# Altium project LightController_SimpleCombo.PrjPCB
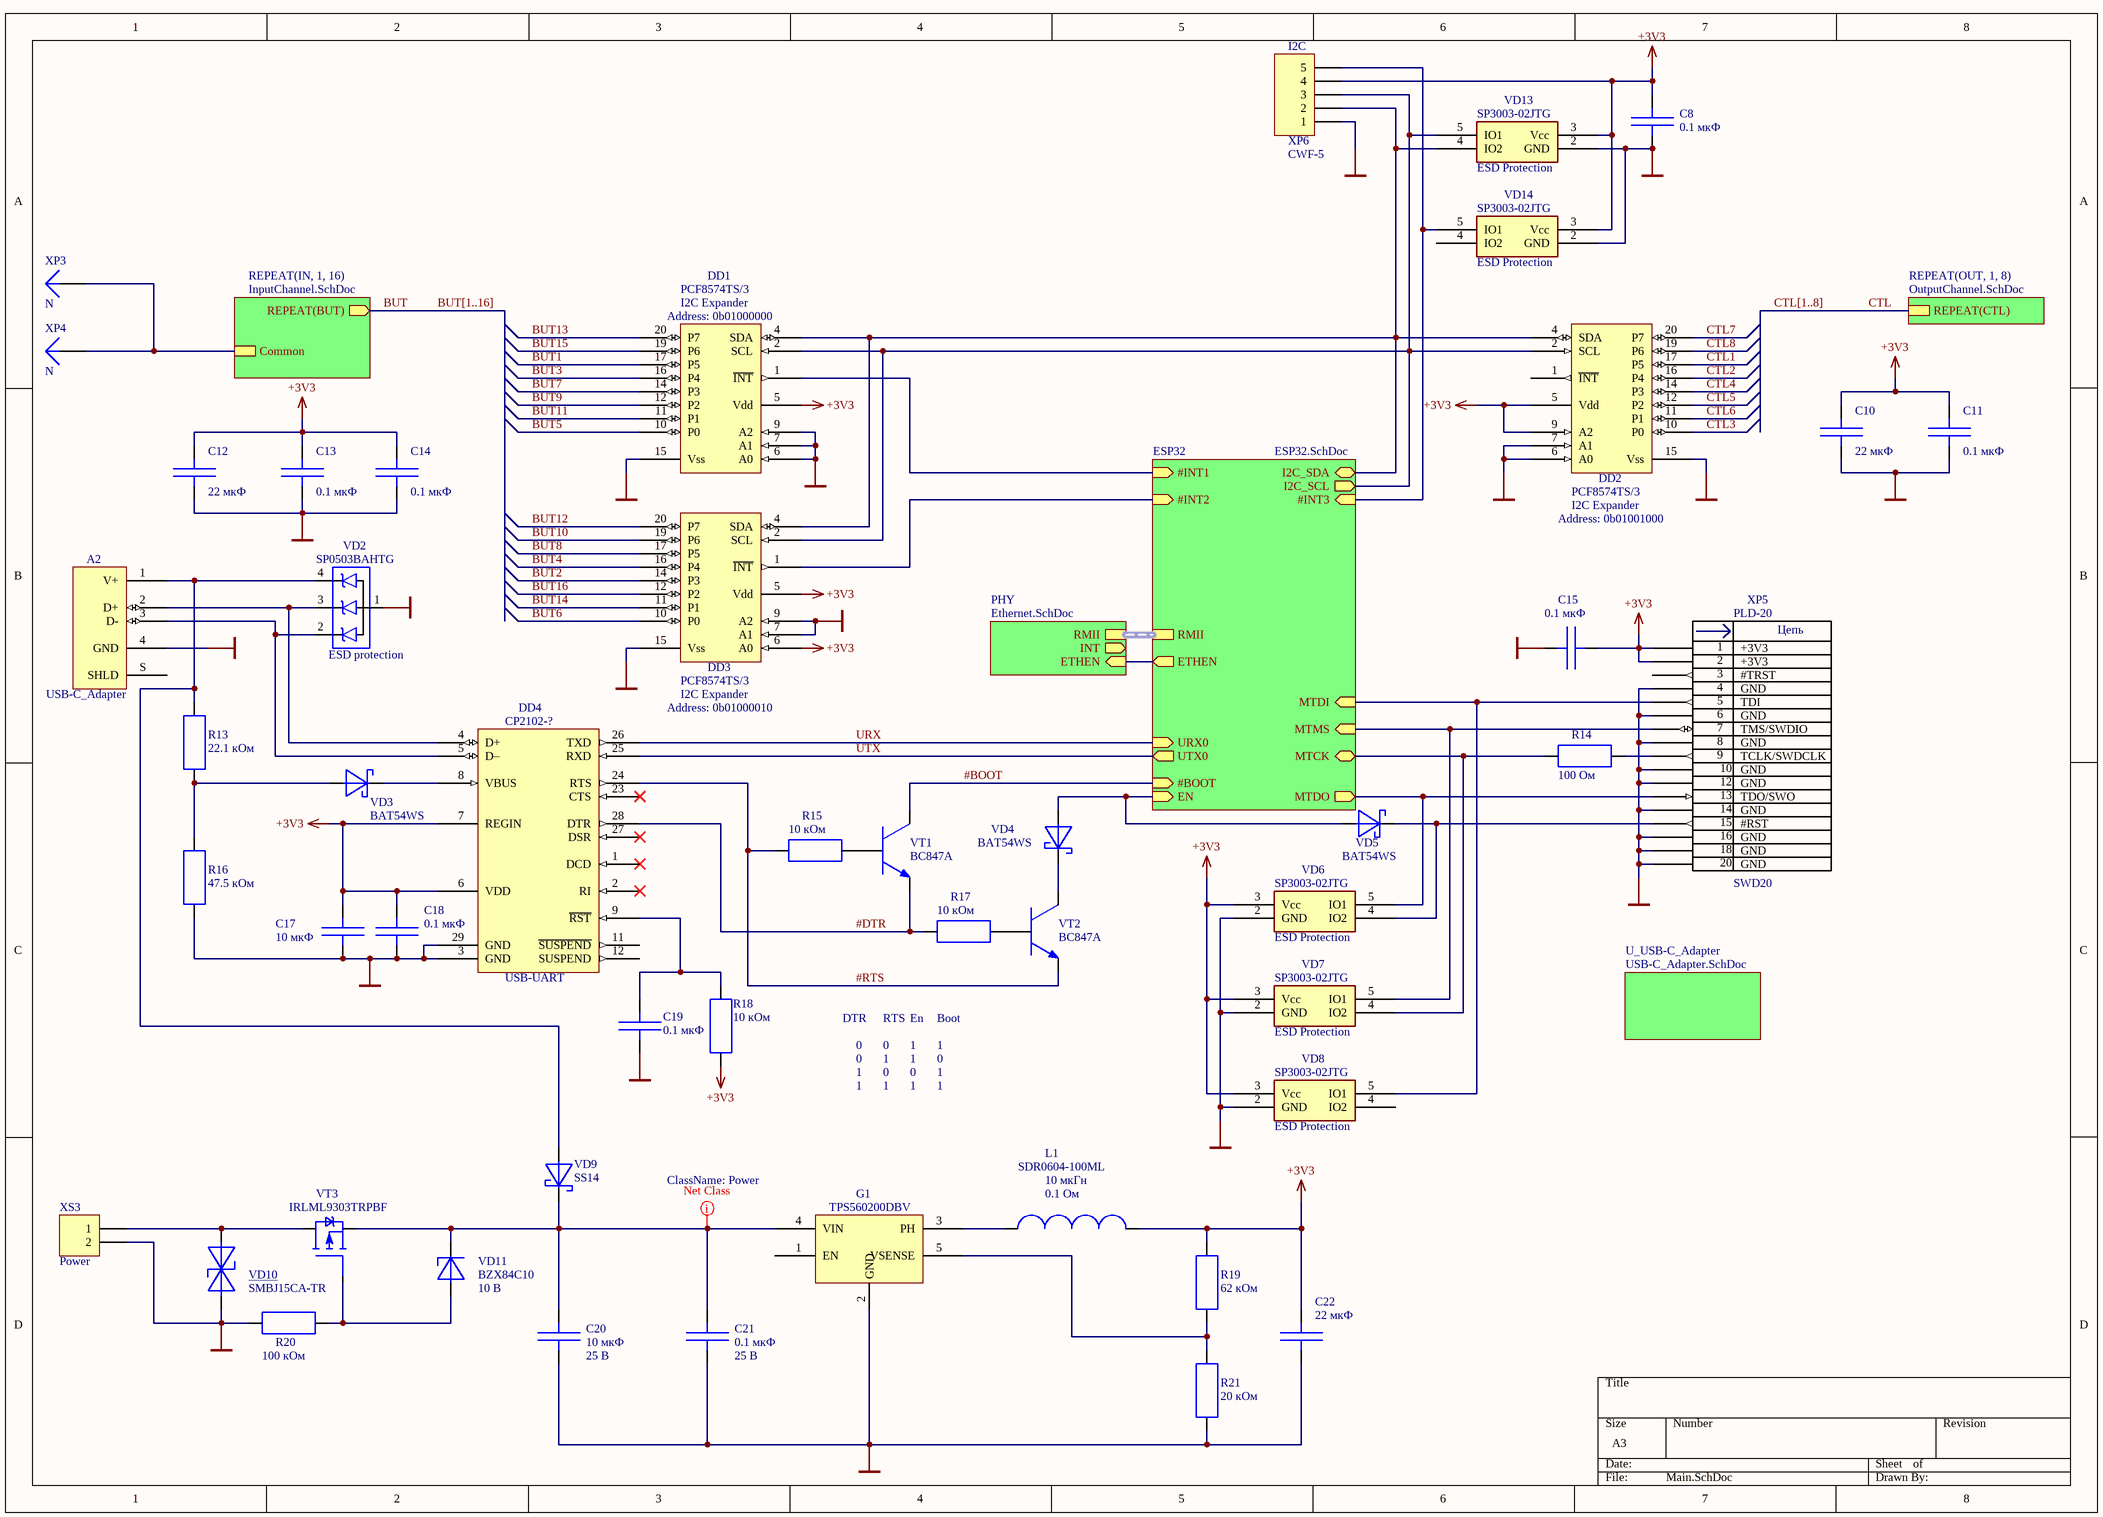
[diagram p0: Main.SchDoc]
6 sheets, 337 parts. Net scope: hierarchical (ports join the sheet entries above them; power ports are global).
Board files: LightController_SimpleCombo.PcbDoc, Usb_Adapter.PcbDoc
Sheets:
  Main.SchDoc
    ESP32 = ESP32.SchDoc
    OUT1 = OutputChannel.SchDoc
    OUT2 = OutputChannel.SchDoc
    OUT3 = OutputChannel.SchDoc
    OUT4 = OutputChannel.SchDoc
    OUT5 = OutputChannel.SchDoc
    OUT6 = OutputChannel.SchDoc
    OUT7 = OutputChannel.SchDoc
    OUT8 = OutputChannel.SchDoc
    IN1 = InputChannel.SchDoc
    IN2 = InputChannel.SchDoc
    IN3 = InputChannel.SchDoc
    IN4 = InputChannel.SchDoc
    IN5 = InputChannel.SchDoc
    IN6 = InputChannel.SchDoc
    IN7 = InputChannel.SchDoc
    IN8 = InputChannel.SchDoc
    IN9 = InputChannel.SchDoc
    IN10 = InputChannel.SchDoc
    IN11 = InputChannel.SchDoc
    IN12 = InputChannel.SchDoc
    IN13 = InputChannel.SchDoc
    IN14 = InputChannel.SchDoc
    IN15 = InputChannel.SchDoc
    IN16 = InputChannel.SchDoc
    PHY = Ethernet.SchDoc
    U_USB-C_Adapter = USB-C_Adapter.SchDoc

## Sheet Main.SchDoc
size A3

### Parts
A2  USB-C_Adapter  [Usb-C_Adapter]  (no BOM)
C8  value 0.1 мкФ  [CAP_0603-1608]  (hidden comment: Cap)
C10  value 22 мкФ  [CAP_0805-2012]  (hidden comment: Cap)
C11  value 0.1 мкФ  [CAP_0603-1608]  (hidden comment: Cap)
C12  value 22 мкФ  [CAP_0805-2012]  (hidden comment: Cap)
C13  value 0.1 мкФ  [CAP_0603-1608]  (hidden comment: Cap)
C14  value 0.1 мкФ  [CAP_0603-1608]  (hidden comment: Cap)
C15  value 0.1 мкФ  [CAP_0603-1608]  (hidden comment: Cap)
C17  value 10 мкФ  [CAP_0603-1608]  (hidden comment: Cap)
C18  value 0.1 мкФ  [CAP_0603-1608]  (hidden comment: Cap)
C19  value 0.1 мкФ  [CAP_0603-1608]  (hidden comment: Cap)
C20  value 10 мкФ  Voltage: 25 В  [CAP_1206-3216]  (hidden comment: Cap)
C21  value 0.1 мкФ  Voltage: 25 В  [CAP_0805-2012]  (hidden comment: Cap)
C22  value 22 мкФ  [CAP_1206-3216]  (hidden comment: Cap)
DD1  I2C Expander  Address: 0b01000000  [TSSOP-0.65-20]
DD2  I2C Expander  Address: 0b01001000  [TSSOP-0.65-20]
DD3  I2C Expander  Address: 0b01000010  [TSSOP-0.65-20]
DD4  USB-UART  Type: CP2102-?  [QFN-0.5-28]
G1  Type: TPS560200DBV  [SOT-23-5]  (hidden comment: DC/DC converter)
L1  value 10 мкГн  Type: SDR0604-100ML  Resistance: 0.1 Ом  [SDR0604]  (hidden comment: Inductor)
R13  value 22.1 кОм  [RES_0603-1608]  (hidden comment: Res)
R14  value 100 Ом  [RES_0603-1608]  (hidden comment: Res)
R15  value 10 кОм  [RES_0603-1608]  (hidden comment: Res)
R16  value 47.5 кОм  [RES_0603-1608]  (hidden comment: Res)
R17  value 10 кОм  [RES_0603-1608]  (hidden comment: Res)
R18  value 10 кОм  [RES_0603-1608]  (hidden comment: Res)
R19  value 62 кОм  [RES_0603-1608]  (hidden comment: Res)
R20  value 100 кОм  [RES_0603-1608]  (hidden comment: Res)
R21  value 20 кОм  [RES_0603-1608]  (hidden comment: Res)
VD2  ESD protection  [SOT143_343127P600-8N]
VD3  Type: BAT54WS  [SOD-323]  (hidden comment: Diode_Schottky)
VD4  Type: BAT54WS  [SOD-323]  (hidden comment: Diode_Schottky)
VD5  Type: BAT54WS  [SOD-323]  (hidden comment: Diode_Schottky)
VD6  ESD Protection  Type: SP3003-02JTG  [SC70-5]
VD7  ESD Protection  Type: SP3003-02JTG  [SC70-5]
VD8  ESD Protection  Type: SP3003-02JTG  [SC70-5]
VD9  Type: SS14  [Diode_SMA]  (hidden comment: Diode_Schottky)
VD10  Type: SMBJ15CA-TR  [Diode_SMB_NP]  (hidden comment: Diode_TVS)
VD11  Type: BZX84C10  Voltage: 10 В  [SOT-23-3]  (hidden comment: Diode_Zener)
VD13  ESD Protection  Type: SP3003-02JTG  [SC70-5]
VD14  ESD Protection  Type: SP3003-02JTG  [SC70-5]
VT1  Type: BC847A  [SOT-23-3]  (hidden comment: Transistor_NPN)
VT2  Type: BC847A  [SOT-23-3]  (hidden comment: Transistor_NPN)
VT3  Type: IRLML9303TRPBF  [SOT-23-3]  (hidden comment: Transistor_P-MOSFET_Enh_Bulk_Shot)
XP3  N  [EK508V_Pin]
XP4  N  [EK508V_Pin]
XP5  SWD20  Type: PLD-20  [IDC-20MS]
XP6  I2C  [CWF-5]
XS3  Power  [DS-261]

### Sub-sheets
ESP32 = ESP32.SchDoc: #BOOT (in), EN (in), UTX0 (out), URX0 (in), MTMS (in), MTDO (out), MTDI (in), MTCK (bidir), #INT1 (in), I2C_SDA (bidir), I2C_SCL (out), #INT2 (in), RMII (harness RMII), ETHEN (out), #INT3 (in)
PHY = Ethernet.SchDoc: RMII (harness RMII), INT (out), ETHEN (in)
REPEAT(IN, 1, 16) = InputChannel.SchDoc: REPEAT(BUT) (out), Common
REPEAT(OUT, 1, 8) = OutputChannel.SchDoc: REPEAT(CTL)
U_USB-C_Adapter = USB-C_Adapter.SchDoc: no entries

### Nets
+3V3: C8.2 C10.2 C11.2 C12.2 C13.2 C14.2 C15.1 C17.2 C18.2 C22.2 DD1.5(Vdd) DD2.5(Vdd) DD2.9(A2) DD3.5(Vdd) DD3.6(A0) DD4.6(VDD) DD4.7(REGIN) L1.2 R18.1 R19.1 VD6.3(Vcc) VD7.3(Vcc) VD8.3(Vcc) VD13.3(Vcc) VD14.3(Vcc) XP5.1(+3V3) XP5.2(+3V3) XP6.4
GND: A2.4(GND) C8.1 C10.1 C11.1 C12.1 C13.1 C14.1 C15.2 C17.1 C18.1 C19.1 C20.1 C21.1 C22.1 DD1.6(A0) DD1.7(A1) DD1.9(A2) DD1.15(Vss) DD2.6(A0) DD2.7(A1) DD2.15(Vss) DD3.7(A1) DD3.9(A2) DD3.15(Vss) DD4.3(GND) DD4.29(GND) G1.2(GND) R16.1 R20.2 R21.2 VD2.1(A) VD6.2(GND) VD7.2(GND) VD8.2(GND) VD10.1(A) VD13.2(GND) VD14.2(GND) XP5.4(GND) XP5.6(GND) XP5.8(GND) XP5.10(GND) XP5.12(GND) XP5.14(GND) XP5.16(GND) XP5.18(GND) XP5.20(GND) XP6.1 XS3.2
#BOOT: VT1.3(C) ; sheet ESP32/#BOOT
#DTR: DD4.28(DTR) R17.1 VT1.2(E)
#RTS: DD4.24(RTS) R15.1 VT2.2(E)
BUT: sheet REPEAT(IN, 1, 16)/REPEAT(BUT)
BUT1: DD1.17(P5)
BUT2: DD3.14(P3)
BUT3: DD1.16(P4)
BUT4: DD3.16(P4)
BUT5: DD1.10(P0)
BUT6: DD3.10(P0)
BUT7: DD1.14(P3)
BUT8: DD3.17(P5)
BUT9: DD1.12(P2)
BUT10: DD3.19(P6)
BUT11: DD1.11(P1)
BUT12: DD3.20(P7)
BUT13: DD1.20(P7)
BUT14: DD3.11(P1)
BUT15: DD1.19(P6)
BUT16: DD3.12(P2)
CTL: sheet REPEAT(OUT, 1, 8)/REPEAT(CTL)
CTL1: DD2.17(P5)
CTL2: DD2.16(P4)
CTL3: DD2.10(P0)
CTL4: DD2.14(P3)
CTL5: DD2.12(P2)
CTL6: DD2.11(P1)
CTL7: DD2.20(P7)
CTL8: DD2.19(P6)
URX: DD4.26(TXD) ; sheet ESP32/URX0
UTX: DD4.25(RXD) ; sheet ESP32/UTX0
NetA1_3: VD4.1(A) VD5.1(A) ; sheet ESP32/EN
NetA1_4: VD14.5(IO1) XP6.5 ; sheet ESP32/#INT3
NetA1_6: DD3.1(~{INT}) ; sheet ESP32/#INT2
NetA1_7: DD1.1(~{INT}) ; sheet ESP32/#INT1
NetA1_13: VD7.5(IO1) XP5.7(TMS/SWDIO) ; sheet ESP32/MTMS
NetA1_14: VD8.5(IO1) XP5.5(TDI) ; sheet ESP32/MTDI
NetA1_16: R14.2 VD7.4(IO2) ; sheet ESP32/MTCK
NetA1_26: DD1.4(SDA) DD2.4(SDA) DD3.4(SDA) VD13.4(IO2) XP6.2 ; sheet ESP32/I2C_SDA
NetA1_27: sheet ESP32/ETHEN, sheet PHY/ETHEN
NetA1_29: DD1.2(SCL) DD2.2(SCL) DD3.2(SCL) VD13.5(IO1) XP6.3 ; sheet ESP32/I2C_SCL
NetA2_1: A2.1(V+) R13.2 VD2.4(K3) VD9.1(A)
NetA2_2: A2.2(D+) DD4.4(D+) VD2.3(K2)
NetA2_3: A2.3(D-) DD4.5(D–) VD2.2(K1)
NetC19_2: C19.2 DD4.9(~{RST}) R18.2
NetC20_2: C20.2 C21.2 G1.4(VIN) VD9.2(K) VD11.2(K) VT3.2(S)
NetDD4_8: DD4.8(VBUS) VD3.2(K)
NetG1_3: G1.3(PH) L1.1
NetG1_5: G1.5(VSENSE) R19.2 R21.1
NetR5_1: VD6.5(IO1) XP5.13(TDO/SWO) ; sheet ESP32/MTDO
NetR11.1_1: XP3.1 XP4.1 ; sheet REPEAT(IN, 1, 16)/Common
NetR13_1: R13.1 R16.2 VD3.1(A)
NetR14_1: R14.1 XP5.9(TCLK/SWDCLK)
NetR15_2: R15.2 VT1.1(B)
NetR17_2: R17.2 VT2.1(B)
NetR20_1: R20.1 VD11.1(A) VT3.1(G)
NetVD4_2: VD4.2(K) VT2.3(C)
NetVD5_2: VD5.2(K) VD6.4(IO2) XP5.15(#RST)
NetVD10_2: VD10.2(K) VT3.3(D) XS3.1

Not connected (* = marked no-connect by the designer): A2 S(SHLD); DD1 3(NC) 8(NC) 13(NC) 18(NC); DD2 1(~{INT}) 3(NC) 8(NC) 13(NC) 18(NC); DD3 3(NC) 8(NC) 13(NC) 18(NC); DD4 1(DCD)* 2(RI)* 10(NC) 11(~{SUSPEND}) 12(SUSPEND) 13(NC) 14(NC) 15(NC) 16(NC) 17(NC) 18(NC) 19(NC) 20(NC) 21(NC) 22(NC) 23(CTS)* 27(DSR)*; G1 1(EN); VD6 1(NC); VD7 1(NC); VD8 1(NC) 4(IO2); VD13 1(NC); VD14 1(NC) 4(IO2); XP5 3(#TRST) 11(NC) 17(NC) 19(NC)

### Buses and harness runs
bus BUT[1..16]
bus CTL[1..8]
harness sheet ESP32/RMII = sheet PHY/RMII

### Layout directives
net class Power: NetC20_2

### Notes on the sheet
- DTR
- 0
- RTS
- 1
- En
- Boot
- (in symbol SWD20) Цепь

### Library data of the parts
C8 = Cap: ЧИП конденсатор керамический; Voltage: 50 В; Type: GRM188R71H104K; Dielectric: X7R; Tolerance: 10%; BomGroup: Конденсаторы; BomTitle: Конденсатор керамический SMD; Case: 0603
C10 C12 = Cap: Конденсатор; Voltage: 6.3 В; Type: GRM21BR60J226M; Dielectric: X5R; BomGroup: Конденсаторы; BomTitle: Конденсатор керамический SMD; Case: 0805
C11 C13-C15 C18 C19 = Cap: Конденсатор; Voltage: 50 В; Type: GRM188R71H104K; Dielectric: X7R; BomGroup: Конденсаторы; BomTitle: Конденсатор керамический SMD; Case: 0603
C17 = Cap: ЧИП конденсатор керамический; Voltage: 6.3 В; Type: GRM188R60J106ME47D; Dielectric: X5R; Tolerance: 10%; BomGroup: Конденсаторы; BomTitle: Конденсатор керамический SMD; Case: 0603
C20 = Cap: ЧИП конденсатор керамический; Type: GRM31CR71E106KA12L; Dielectric: X5R; Tolerance: 10%; BomGroup: Конденсаторы; BomTitle: Конденсатор керамический SMD; Case: 1206
C21 = Cap: ЧИП конденсатор керамический; Type: GRM21BR71E104KA01L; Dielectric: X7R; Tolerance: 10%; BomGroup: Конденсаторы; BomTItle: Конденсатор керамический SMD; Case: 0805
C22 = Cap: ЧИП конденсатор керамический; Voltage: 16 В; Type: GRM31CR61C226ME15L; Dielectric: X5R; Tolerance: 20%; BomGroup: Конденсаторы; BomTitle: Конденсатор керамический SMD; Case: 1206
DD1-DD3 = PCF8574TS/3: Remote 8-bit I/O expander for I2C-bus with interrupt; BomGroup: Микросхемы; BomTitle: Микросхема; AddressTemplate: 0b0100xxx0; Type: PCF8574TS/3
DD4 = CP2102_QFN28: SINGLE-CHIP USB-TO-UART BRIDGE; BomGroup: Микросхемы; BomTitle: Микросхема
G1 = TPS560200: 4.5-V to 17-V Input, 500-mA Synchronous Step-Down Converter With  Advanced Eco-Mode; BomGroup: Микросхемы; BomTitle: Микросхема; Case: SOT23-5
L1 = Inductor: ЧИП катушка индуктивности; Tolerance: 20%; BomTitle: Индуктивность SMD; Case: SDR0604; BomGroup: Индуктивности
R13-R18 = Res: Резистор постоянный; Power: 0.125 W; Tolerance: 5%; BomGroup: Резисторы; BomTitle: Резистор SMD; Case: 0603
R19 = Res: ЧИП резистор постоянный; Power: 0.1 W; Tolerance: 1%; BomGroup: Резисторы; BomTitle: Резистор SMD; Case: 0603; Type: CRCW060362K0FK
R20 = Res: ЧИП резистор постоянный; Power: 0.1 W; Tolerance: 5%; BomGroup: Резисторы; BomTitle: Резистор SMD; Case: 0603
R21 = Res: ЧИП резистор постоянный; Tolerance: 1%; BomGroup: Резисторы; BomTitle: Резистор SMD; Case: 0603; Type: CRCW060320K0FKEA
VD2 = SP0503BAHTG: 3 Channel 30pF 30kV Unidirectional TVS Array; BomGroup: Микросхемы; BomTitle: Микросхема; Type: SP0503BAHTG
VD3-VD5 VD9 = Diode_Schottky: Диод Шоттки; BomGroup: Диоды; BomTitle: Диод Шоттки
  VD3-VD5: Case: SOD-323
  VD9: Case: SMA
VD6-VD8 VD13 VD14 = SP3003-02J: BomGroup: Микросхемы; BomTitle: Микросхема; Case: SC70-5
VD10 = Diode_TVS: Диод лавинный двуханодный (TVS, супрессор); BomGroup: Диоды; Case: SMB; BomTitle: Супрессор
VD11 = Diode_Zener: Диод лавинный выпрямительный (стабилитрон); pin to pad: 2>3; BomGroup: Диоды; Case: SOT-23-3; BomTitle: Стабилитрон
VT1 VT2 = Transistor_NPN: Транзистор биполярный NPN; BomGroup: Транзисторы; Case: SOT23-3; BomTitle: Транзистор биполярный
VT3 = Transistor_P-MOSFET_Enh_Bulk_Shot: P-канальный полевой транзистор с изолированным затвором обогащенного типа с соединением истока и подложки c диодом Шоттки; BomGroup: Транзисторы; BomTitle: Транзистор P-канальный; Case: SOT-23-3
XP3 XP4 = Plug: LatestRevisionDate: 17-Jul-2002; LatestRevisionNote: Re-released for DXP Platform.; Publisher: Altium Limited
XP5 = SWD20: SWD connector; BomGroup: Соединители; BomTitle: Соединитель штыревой
XP6 = Header 5: Header, 5-Pin; BomGroup: Соединители; BomTitle: Соединитель штыревой; Type: CWF-5
XS3 = Header 2: BomGroup: Соединители; BomTitle: Клеммник нажимной; Type: DG141V-2.54-02P

## Sheet ESP32.SchDoc
size A4
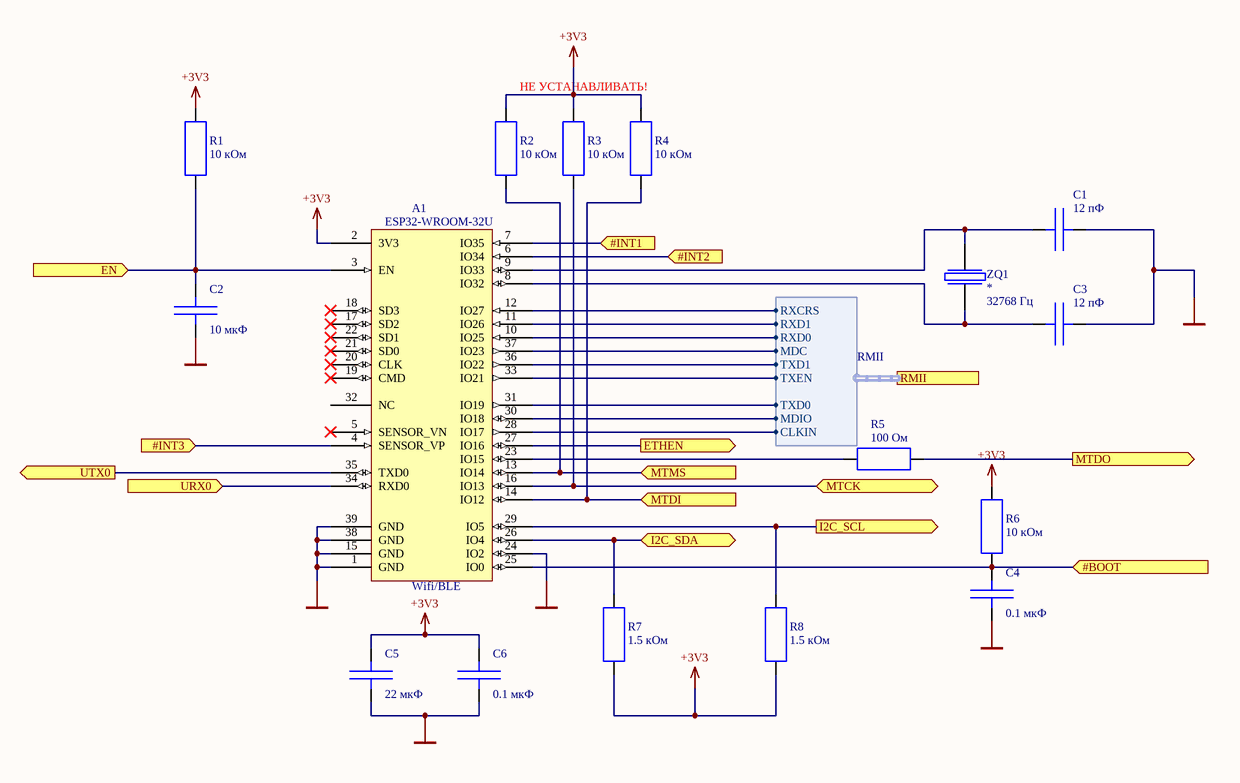
[diagram p1: ESP32.SchDoc]

### Parts
A1  Wifi/BLE  Type: ESP32-WROOM-32U  [ESP-WROOM-32]
C1  value 12 пФ  [CAP_0603-1608]  (hidden comment: Cap)
C2  value 10 мкФ  [CAP_0603-1608]  (hidden comment: Cap)
C3  value 12 пФ  [CAP_0603-1608]  (hidden comment: Cap)
C4  value 0.1 мкФ  [CAP_0603-1608]  (hidden comment: Cap)
C5  value 22 мкФ  [CAP_0805-2012]  (hidden comment: Cap)
C6  value 0.1 мкФ  [CAP_0603-1608]  (hidden comment: Cap)
R1  value 10 кОм  [RES_0603-1608]  (hidden comment: Res)
R2  value 10 кОм  [RES_0603-1608]  (hidden comment: Res)
R3  value 10 кОм  [RES_0603-1608]  (hidden comment: Res)
R4  НЕ УСТАНАВЛИВАТЬ!  value 10 кОм  [RES_0603-1608]
R5  value 100 Ом  [RES_0603-1608]  (hidden comment: Res)
R6  value 10 кОм  [RES_0603-1608]  (hidden comment: Res)
R7  value 1.5 кОм  [RES_0603-1608]  (hidden comment: Res)
R8  value 1.5 кОм  [RES_0603-1608]  (hidden comment: Res)
ZQ1  value 32768 Гц  [KX-327NHT]  (hidden comment: Quartz_GOST)

### Ports
#BOOT (in), #INT1 (in), #INT2 (in), #INT3 (in), EN (in), ETHEN (out), I2C_SCL (out), I2C_SDA (bidir), MTCK (bidir), MTDI (in), MTDO (out), MTMS (in), RMII (harness RMII), URX0 (in), UTX0 (out)

### Harnesses
RMII: RXCRS, RXD1, RXD0, MDC, TXEN, TXD0, MDIO, CLKIN, TXD1

### Nets
+3V3: A1.2(3V3) C5.2 C6.2 R1.2 R2.2 R3.2 R4.2 R6.2 R7.1 R8.1
GND: A1.1(GND) A1.15(GND) A1.24(IO2) A1.38(GND) A1.39(GND) C1.2 C2.1 C3.2 C4.1 C5.1 C6.1
#BOOT: A1.25(IO0) C4.2 R6.1 ; port #BOOT
PHYCLK: A1.28(IO17) ; port RMII.CLKIN
URX: A1.34(RXD0) ; port URX0
UTX: A1.35(TXD0) ; port UTX0
NetA1_3: A1.3(EN) C2.2 R1.1 ; port EN
NetA1_4: A1.4(SENSOR_VP) ; port #INT3
NetA1_6: A1.6(IO34) ; port #INT2
NetA1_7: A1.7(IO35) ; port #INT1
NetA1_8: A1.8(IO32) C3.1 ZQ1.2
NetA1_9: A1.9(IO33) C1.1 ZQ1.1
NetA1_10: A1.10(IO25) ; port RMII.RXD0
NetA1_11: A1.11(IO26) ; port RMII.RXD1
NetA1_12: A1.12(IO27) ; port RMII.RXCRS
NetA1_13: A1.13(IO14) R2.1 ; port MTMS
NetA1_14: A1.14(IO12) R4.1 ; port MTDI
NetA1_16: A1.16(IO13) R3.1 ; port MTCK
NetA1_23: A1.23(IO15) R5.2
NetA1_26: A1.26(IO4) R7.2 ; port I2C_SDA
NetA1_27: A1.27(IO16) ; port ETHEN
NetA1_29: A1.29(IO5) R8.2 ; port I2C_SCL
NetA1_30: A1.30(IO18) ; port RMII.MDIO
NetA1_31: A1.31(IO19) ; port RMII.TXD0
NetA1_33: A1.33(IO21) ; port RMII.TXEN
NetA1_36: A1.36(IO22) ; port RMII.TXD1
NetA1_37: A1.37(IO23) ; port RMII.MDC
NetR5_1: R5.1 ; port MTDO

Not connected (* = marked no-connect by the designer): A1 5(SENSOR_VN)* 17(SD2)* 18(SD3)* 19(CMD)* 20(CLK)* 21(SD0)* 22(SD1)* 32(NC)

### Library data of the parts
A1 = ESP-WROOM-32: Wi-Fi+BT+BLE MCU module; BomGroup: Микросхемы; BomTitle: Микросхема
C1 C3 = Cap: Конденсатор; Voltage: 50 В; Type: GRM1885C1H120J; Dielectric: NP0; BomGroup: Конденсаторы; BomTitle: Конденсатор керамический SMD; Case: 0603
C2 = Cap: Конденсатор; Voltage: 6.3 В; Type: GRM188R60J106ME47D; Dielectric: X5R; BomGroup: Конденсаторы; BomTitle: Конденсатор керамический SMD; Case: 0603
C4 C6 = Cap: as C11 on sheet Main; Case: 0603
C5 = Cap: as C10 on sheet Main; Case: 0805
R1-R8 = Res: as R13 on sheet Main; Case: 0603
ZQ1 = Quartz_GOST: Кварцевый резонатор; BomGroup: Прочее; Type: *; BomTitle: Кварцевый резонатор

## Sheet OutputChannel.SchDoc
size A4
Used 8 times, as channels OUT1, OUT2, OUT3, OUT4, OUT5, OUT6, OUT7, OUT8. Parts and nets are listed once, with the designators drawn on the sheet.
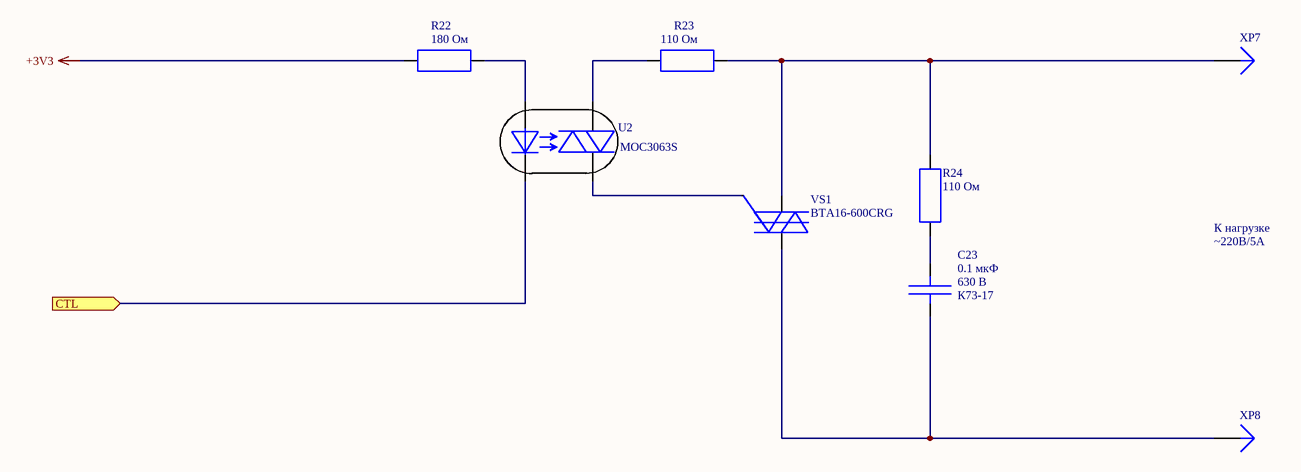
[diagram p2: OutputChannel.SchDoc]

### Parts
C23  value 0.1 мкФ  Voltage: 630 В  Type: К73-17  [B32652A6-7-12.5-18]  (hidden comment: Cap)
R22  value 180 Ом  [RES_0603-1608]  (hidden comment: Res)
R23  value 110 Ом  [RES_2512-6332]  (hidden comment: Res)
R24  value 110 Ом  [RES_2512-6332]  (hidden comment: Res)
U2  Type: MOC3063S  [SMD-2.54-6]  (hidden comment: OptoIso_Triac)
VS1  Type: BTA16-600CRG  [TO-220FP]  (hidden comment: Diode_TRIAC)
XP7  Plug  [EK508V_Pin]  (value not drawn)  (no BOM)
XP8  Plug  [EK508V_Pin]  (value not drawn)  (no BOM)

### Ports
CTL (in)

### Nets
+3V3: R22.2
CTL: U2.2(K1) ; port CTL
NetC23_1: C23.1 VS1.1(A) XP8.1
NetC23_2: C23.2 R24.2
NetR22_1: R22.1 U2.1(A1)
NetR23_1: R23.1 R24.1 VS1.2(K) XP7.1
NetR23_2: R23.2 U2.3(A2)
NetU2_4: U2.4(K2) VS1.3(G)

### Channels
OUT1: designators end in .1; ports CTL=CTL1
OUT2: designators end in .2; ports CTL=CTL2
OUT3: designators end in .3; ports CTL=CTL3
OUT4: designators end in .4; ports CTL=CTL4
OUT5: designators end in .5; ports CTL=CTL5
OUT6: designators end in .6; ports CTL=CTL6
OUT7: designators end in .7; ports CTL=CTL7
OUT8: designators end in .8; ports CTL=CTL8

### Notes on the sheet
- К нагрузке
- ~220В/5А

### Library data of the parts
C23 = Cap: Конденсатор; BomGroup: Конденсаторы; BomTitle: Конденсатор металлоплёночный
R22 = Res: as R20 on sheet Main; Case: 0603
R23 R24 = Res: ЧИП резистор постоянный; Power: 2 W; Tolerance: 5%; BomGroup: Резисторы; BomTitle: Резистор SMD; Case: 2512; Type: CRM2512-JW-150ELF
U2 = OptoIso_Triac: Оптопара симисторная; pin to pad: 3>6; BomGroup: Оптоэлектронные приборы; BomTitle: Оптосимистор; Case: SMD-6
VS1 = Diode_TRIAC: Тиристор триодный симметричный двунаправленный; BomGroup: Диоды; BomTitle: Симистор; Case: TO-220FP
XP7 XP8 = Plug: LatestRevisionDate: 17-Jul-2002; LatestRevisionNote: Re-released for DXP Platform.; Publisher: Altium Limited

## Sheet InputChannel.SchDoc
size A4
Used 16 times, as channels IN1, IN2, IN3, IN4, IN5, IN6, IN7, IN8, IN9, IN10, IN11, IN12, IN13, IN14, IN15, IN16. Parts and nets are listed once, with the designators drawn on the sheet.
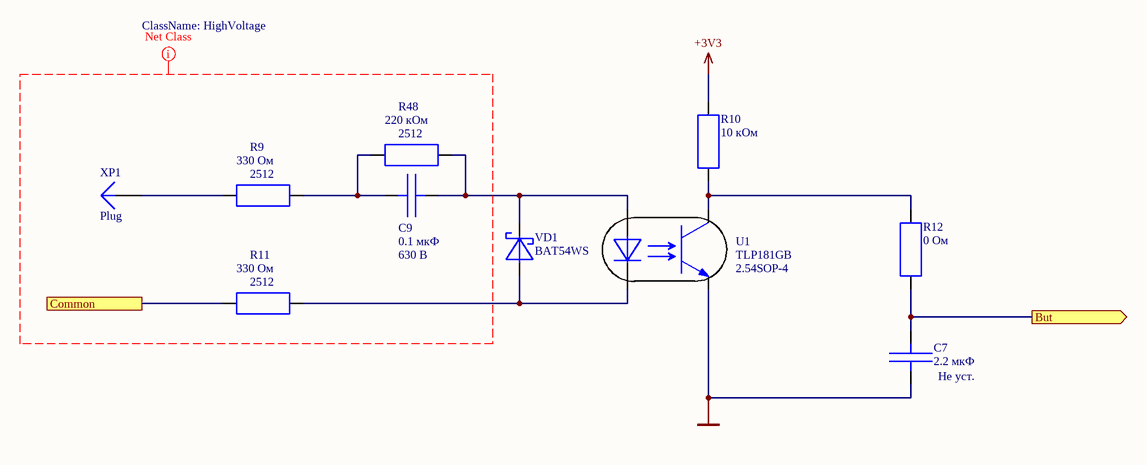
[diagram p3: InputChannel.SchDoc]

### Parts
C7  Не уст.  value 2.2 мкФ  [CAP_0603-1608]  (no BOM)
C9  value 0.1 мкФ  Voltage: 630 В  [CAP_1812-4532]  (hidden comment: Cap)
R9  value 330 Ом  Case: 2512  [RES_2512-6332]  (hidden comment: Res)
R10  value 10 кОм  [RES_0603-1608]  (hidden comment: Res)
R11  value 330 Ом  Case: 2512  [RES_2512-6332]  (hidden comment: Res)
R12  value 0 Ом  [RES_0603-1608]  (hidden comment: Res)
R48  value 220 кОм  Case: 2512  [RES_2512-6332]  (hidden comment: Res)
U1  Case: 2.54SOP-4  Type: TLP181GB  [SOP-2.54-4]  (hidden comment: OptoIso_Trans)
VD1  Type: BAT54WS  [SOD-323]  (hidden comment: Diode_Schottky)
XP1  Plug  [EK508V_Pin]  (no BOM)

### Ports
But (out), Common

### Nets
+3V3: R10.2
GND: C7.1 U1.3(E)
But: C7.2 R12.1 ; port But
Common: R11.1 ; port Common
NetC9_1: C9.1 R48.2 U1.1(A) VD1.2(K)
NetC9_2: C9.2 R9.2 R48.1
NetR9_1: R9.1 XP1.1
NetR10_1: R10.1 R12.2 U1.4(C)
NetR11_2: R11.2 U1.2(K) VD1.1(A)

### Channels
IN1: designators end in .1; ports But=BUT1 Common=NetR11.1_1
IN2: designators end in .2; ports But=BUT2 Common=NetR11.1_1
IN3: designators end in .3; ports But=BUT3 Common=NetR11.1_1
IN4: designators end in .4; ports But=BUT4 Common=NetR11.1_1
IN5: designators end in .5; ports But=BUT5 Common=NetR11.1_1
IN6: designators end in .6; ports But=BUT6 Common=NetR11.1_1
IN7: designators end in .7; ports But=BUT7 Common=NetR11.1_1
IN8: designators end in .8; ports But=BUT8 Common=NetR11.1_1
IN9: designators end in .9; ports But=BUT9 Common=NetR11.1_1
IN10: designators end in .10; ports But=BUT10 Common=NetR11.1_1
IN11: designators end in .11; ports But=BUT11 Common=NetR11.1_1
IN12: designators end in .12; ports But=BUT12 Common=NetR11.1_1
IN13: designators end in .13; ports But=BUT13 Common=NetR11.1_1
IN14: designators end in .14; ports But=BUT14 Common=NetR11.1_1
IN15: designators end in .15; ports But=BUT15 Common=NetR11.1_1
IN16: designators end in .16; ports But=BUT16 Common=NetR11.1_1

### Layout directives
net class HighVoltage: (no net found under the mark)

### Library data of the parts
C7 = Cap: Конденсатор; Voltage: 6.3 В; Dielectric: X7R; BomGroup: Конденсаторы; BomTitle: Конденсатор керамический SMD; Case: 0603
C9 = Cap: Конденсатор; Type: GRM43DR72J104K; Dielectric: X7R; BomGroup: Конденсаторы; BomTitle: Конденсатор керамический SMD; Case: 1812
R9-R12 R48 = Res: Резистор постоянный; Tolerance: 5%; BomGroup: Резисторы; BomTitle: Резистор SMD
  R10: Power: *; Case: 0603; Type: *
  R12: Case: 0603
U1 = OptoIso_Trans: Оптопара транзисторная; BomGroup: Оптоэлектронные приборы; BomTitle: Оптопара транзисторная
VD1 = Diode_Schottky: Диод Шоттки; BomGroup: Диоды; Case: SOD-323; BomTitle: Диод Шоттки
XP1 = Plug: LatestRevisionDate: 17-Jul-2002; LatestRevisionNote: Re-released for DXP Platform.; Publisher: Altium Limited

## Sheet Ethernet.SchDoc
size A3
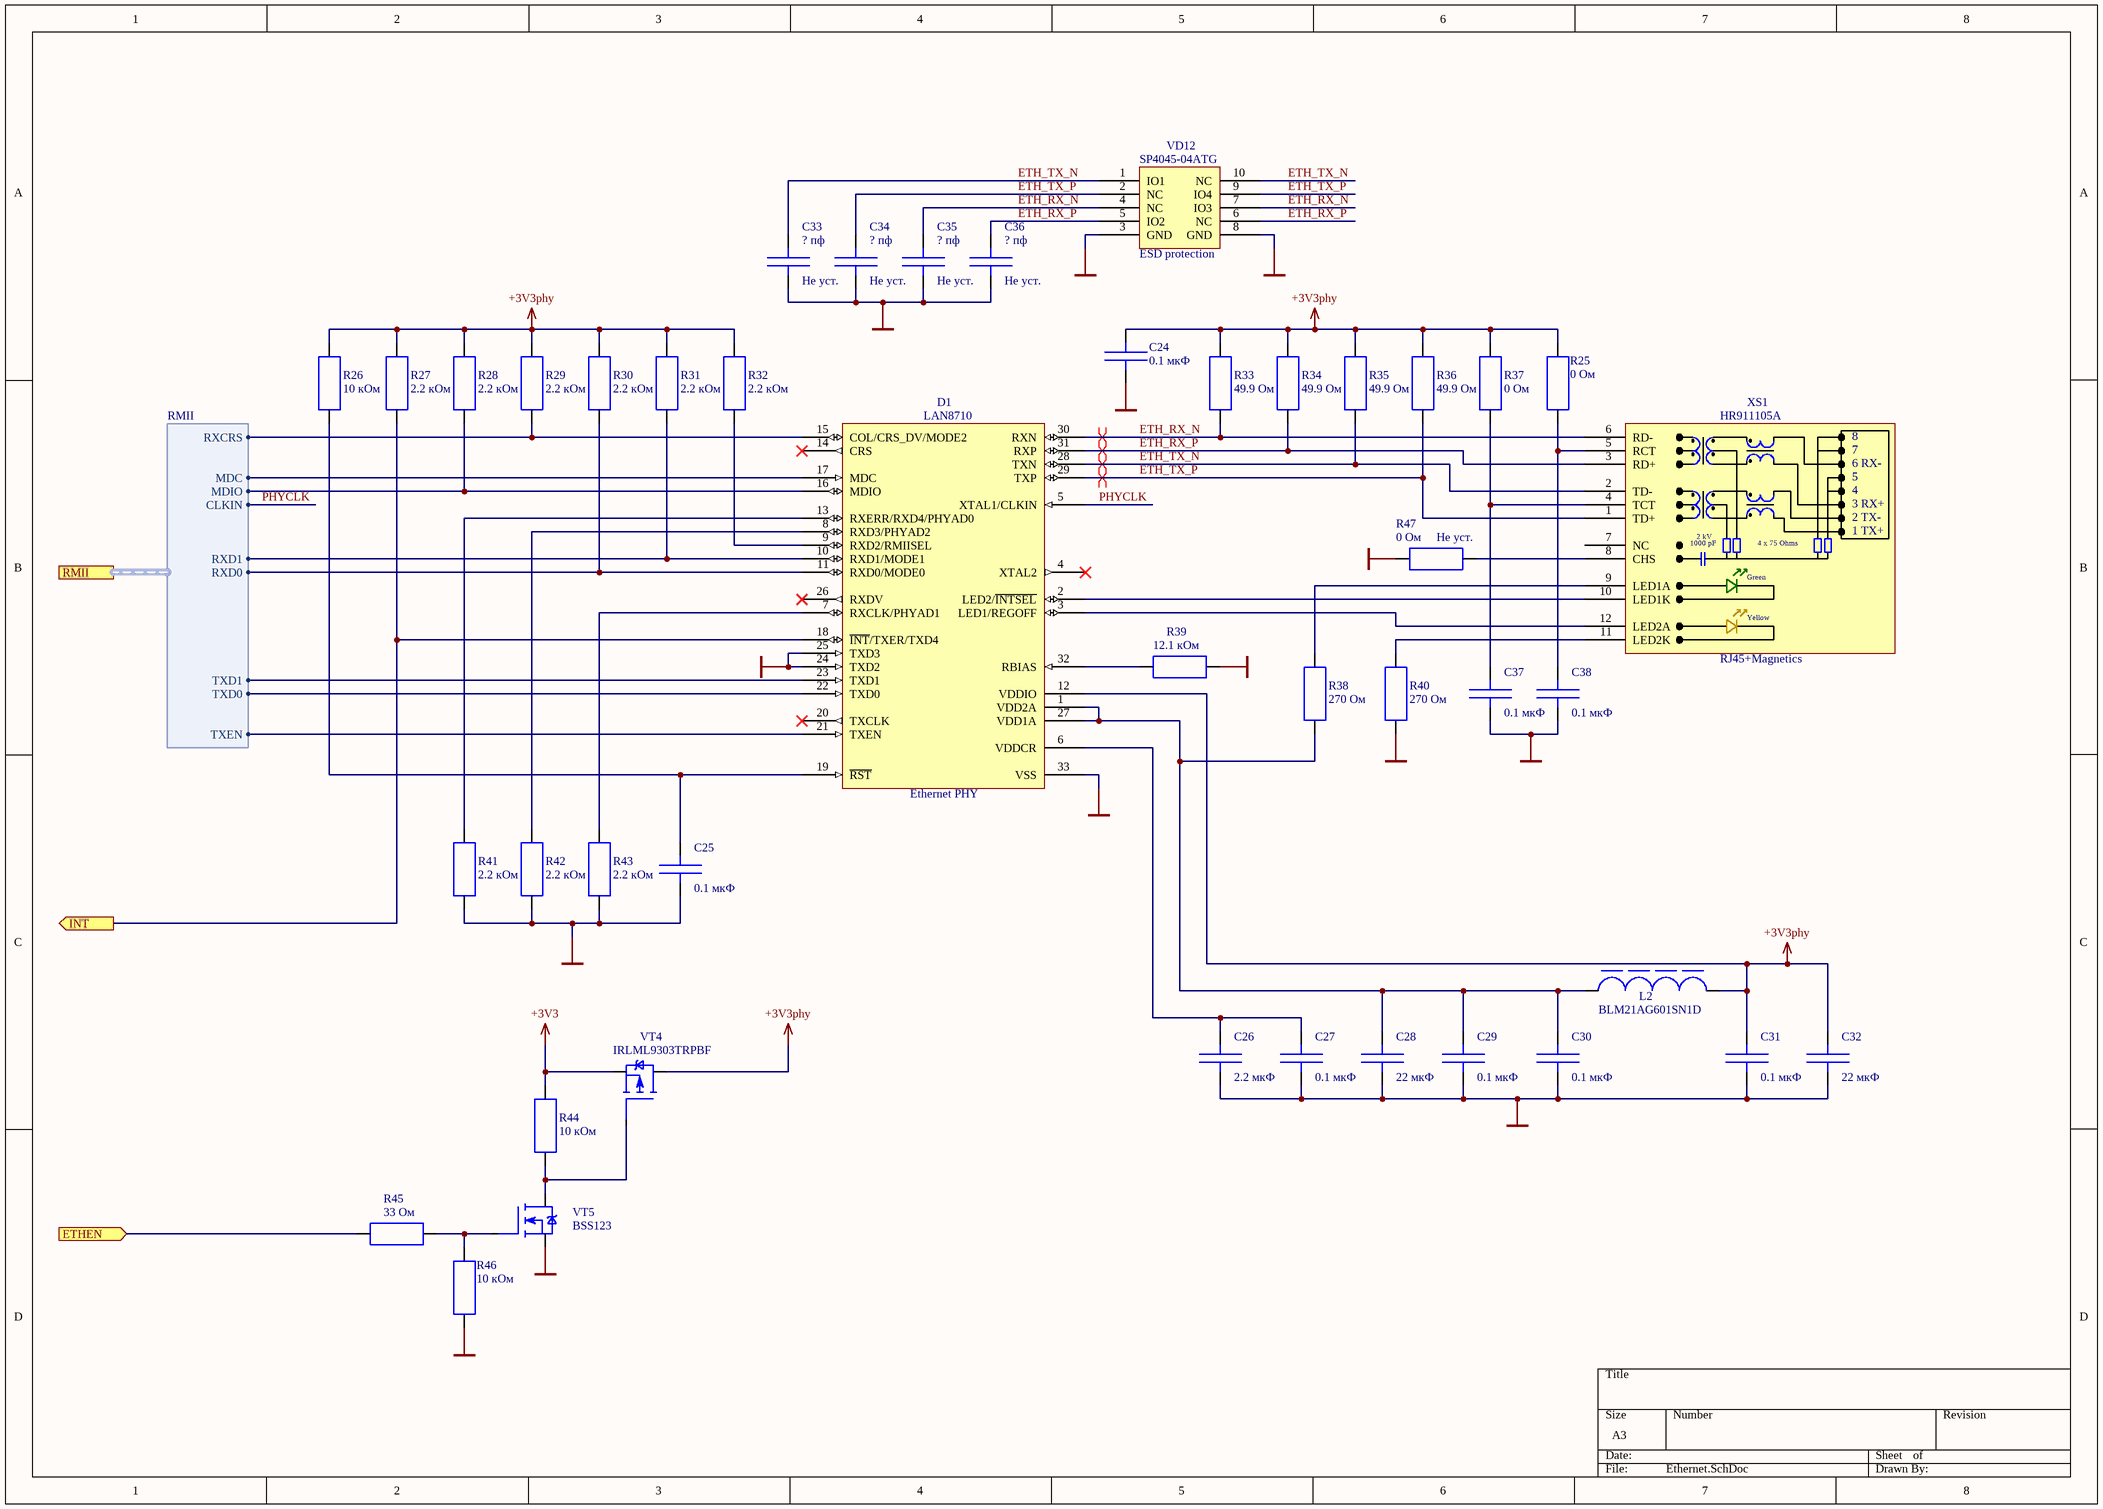
[diagram p4: Ethernet.SchDoc]

### Parts
C24  value 0.1 мкФ  [CAP_0603-1608]  (hidden comment: Cap)
C25  value 0.1 мкФ  [CAP_0603-1608]  (hidden comment: Cap)
C26  value 2.2 мкФ  [CAP_0603-1608]  (hidden comment: Cap)
C27  value 0.1 мкФ  [CAP_0603-1608]  (hidden comment: Cap)
C28  value 22 мкФ  [CAP_0805-2012]  (hidden comment: Cap)
C29  value 0.1 мкФ  [CAP_0603-1608]  (hidden comment: Cap)
C30  value 0.1 мкФ  [CAP_0603-1608]  (hidden comment: Cap)
C31  value 0.1 мкФ  [CAP_0603-1608]  (hidden comment: Cap)
C32  value 22 мкФ  [CAP_0805-2012]  (hidden comment: Cap)
C33  Не уст.  value ? пф  [CAP_0603-1608]  (no BOM)
C34  Не уст.  value ? пф  [CAP_0603-1608]  (no BOM)
C35  Не уст.  value ? пф  [CAP_0603-1608]  (no BOM)
C36  Не уст.  value ? пф  [CAP_0603-1608]  (no BOM)
C37  value 0.1 мкФ  [CAP_0603-1608]  (hidden comment: Cap)
C38  value 0.1 мкФ  [CAP_0603-1608]  (hidden comment: Cap)
D1  Ethernet PHY  [QFN-0.5-32]
L2  Type: BLM21AG601SN1D  [CAP_0805-2012]  (hidden comment: Inductor_Ferrite)
R25  value 0 Ом  [RES_0603-1608]  (hidden comment: Res)
R26  value 10 кОм  [RES_0603-1608]  (hidden comment: Res)
R27  value 2.2 кОм  [RES_0603-1608]  (hidden comment: Res)
R28  value 2.2 кОм  [RES_0603-1608]  (hidden comment: Res)
R29  value 2.2 кОм  [RES_0603-1608]  (hidden comment: Res)
R30  value 2.2 кОм  [RES_0603-1608]  (hidden comment: Res)
R31  value 2.2 кОм  [RES_0603-1608]  (hidden comment: Res)
R32  value 2.2 кОм  [RES_0603-1608]  (hidden comment: Res)
R33  value 49.9 Ом  [RES_0603-1608]  (hidden comment: Res)
R34  value 49.9 Ом  [RES_0603-1608]  (hidden comment: Res)
R35  value 49.9 Ом  [RES_0603-1608]  (hidden comment: Res)
R36  value 49.9 Ом  [RES_0603-1608]  (hidden comment: Res)
R37  value 0 Ом  [RES_0603-1608]  (hidden comment: Res)
R38  value 270 Ом  [RES_0603-1608]  (hidden comment: Res)
R39  value 12.1 кОм  [RES_0603-1608]  (hidden comment: Res)
R40  value 270 Ом  [RES_0603-1608]  (hidden comment: Res)
R41  value 2.2 кОм  [RES_0603-1608]  (hidden comment: Res)
R42  value 2.2 кОм  [RES_0603-1608]  (hidden comment: Res)
R43  value 2.2 кОм  [RES_0603-1608]  (hidden comment: Res)
R44  value 10 кОм  [RES_0603-1608]  (hidden comment: Res)
R45  value 33 Ом  [RES_0603-1608]  (hidden comment: Res)
R46  value 10 кОм  [RES_0603-1608]  (hidden comment: Res)
R47  Не уст.  value 0 Ом  [RES_0603-1608]  (no BOM)
VD12  ESD protection  [MSOP-0.5-10]
VT4  Type: IRLML9303TRPBF  [SOT-23-3]  (hidden comment: Transistor_P-MOSFET_Enh_Bulk_Shot)
VT5  Type: BSS123  [SOT-23-3]  (hidden comment: Transistor_N-MOSFET_Enh_Bulk_Shot)
XS1  RJ45+Magnetics  [HR911105A]

### Ports
ETHEN (in), INT (out), RMII (harness RMII)

### Harnesses
RMII: CLKIN, MDC, MDIO, RXCRS, RXD0, RXD1, TXD0, TXD1, TXEN

### Nets
+3V3: R44.1 VT4.2(S)
+3V3phy: C24.1 C31.2 C32.2 D1.12(VDDIO) L2.2 R25.1 R26.2 R27.2 R28.2 R29.2 R30.2 R31.2 R32.2 R33.2 R34.2 R35.2 R36.2 R37.2 VT4.3(D)
GND: C24.2 C25.1 C26.1 C27.1 C28.1 C29.1 C30.1 C31.1 C32.1 C33.2 C34.2 C35.2 C36.2 C37.2 C38.2 D1.24(TXD2) D1.25(TXD3) D1.33(VSS) R39.2 R40.1 R41.2 R42.2 R43.2 R46.2 R47.1 VD12.3(GND) VD12.8(GND) VT5.2(S)
ETH_RX_N: C35.1 D1.30(RXN) R33.1 VD12.4(NC) VD12.7(IO3) XS1.6(RD-)
ETH_RX_P: C36.1 D1.31(RXP) R34.1 VD12.5(IO2) VD12.6(NC) XS1.3(RD+)
ETH_TX_N: C33.1 D1.28(TXN) R35.1 VD12.1(IO1) VD12.10(NC) XS1.2(TD-)
ETH_TX_P: C34.1 D1.29(TXP) R36.1 VD12.2(NC) VD12.9(IO4) XS1.1(TD+)
PHYCLK: D1.5(XTAL1/CLKIN) ; port RMII.CLKIN
NetA1_10: D1.11(RXD0/MODE0) R30.1 ; port RMII.RXD0
NetA1_11: D1.10(RXD1/MODE1) R31.1 ; port RMII.RXD1
NetA1_12: D1.15(COL/CRS_DV/MODE2) R29.1 ; port RMII.RXCRS
NetA1_27: R45.2 ; port ETHEN
NetA1_30: D1.16(MDIO) R28.1 ; port RMII.MDIO
NetA1_31: D1.22(TXD0) ; port RMII.TXD0
NetA1_33: D1.21(TXEN) ; port RMII.TXEN
NetA1_36: D1.23(TXD1) ; port RMII.TXD1
NetA1_37: D1.17(MDC) ; port RMII.MDC
NetC25_2: C25.2 D1.19(~{RST}) R26.1
NetC26_2: C26.2 C27.2 D1.6(VDDCR)
NetC28_2: C28.2 C29.2 C30.2 D1.1(VDD2A) D1.27(VDD1A) L2.1 R38.2
NetC37_1: C37.1 R37.1 XS1.4(TCT)
NetC38_1: C38.1 R25.2 XS1.5(RCT)
NetD1_2: D1.2(LED2/~{INTSEL}) XS1.10(LED1K)
NetD1_3: D1.3(LED1/REGOFF) XS1.12(LED2A)
NetD1_7: D1.7(RXCLK/PHYAD1) R43.1
NetD1_8: D1.8(RXD3/PHYAD2) R42.1
NetD1_9: D1.9(RXD2/RMIISEL) R32.1
NetD1_13: D1.13(RXERR/RXD4/PHYAD0) R41.1
NetD1_18: D1.18(~{INT}/TXER/TXD4) R27.1 ; port INT
NetD1_32: D1.32(RBIAS) R39.1
NetR38_1: R38.1 XS1.9(LED1A)
NetR40_2: R40.2 XS1.11(LED2K)
NetR44_2: R44.2 VT4.1(G) VT5.3(D)
NetR45_1: R45.1 R46.1 VT5.1(G)
NetR47_2: R47.2 XS1.8(CHS)

Not connected (* = marked no-connect by the designer): D1 4(XTAL2)* 14(CRS)* 20(TXCLK)* 26(RXDV)*; XS1 7(NC)

### Layout directives
differential pair: ETH_RX_N, ETH_RX_P, ETH_TX_N, ETH_TX_P

### Notes on the sheet
- (in symbol HR911105A) 6 RX-; 3 RX+; 2 TX-; 1 TX+; 1000 pF; 2 kV; 4 x 75 Ohms; Green; Yellow

### Library data of the parts
C24 C25 C27 C29-C31 C33-C38 = Cap: as C11 on sheet Main; Case: 0603
C26 = Cap: Конденсатор; Voltage: 10 В; Type: GRM188R61A225K; Dielectric: X5R; BomGroup: Конденсаторы; BomTitle: Конденсатор керамический SMD; Case: 0603
C28 C32 = Cap: as C10 on sheet Main; Case: 0805
D1 = LAN8710: 10/100 Ethernet MII/RMII Transceiver; BomGroup: Микросхемы; BomTitle: Микросхема; Type: LAN8710
L2 = Inductor_Ferrite: Катушка идуктивности с магнитодиэлектрическим магнитопроводом; BomGroup: Индуктивности; BomTitle: Дроссель подавления ЭМП; Case: 0805
R25-R43 R47 = Res: as R13 on sheet Main; Case: 0603
R44-R46 = Res: as R20 on sheet Main; Case: 0603
VD12 = SP4045-04ATG: 1.5pF 24A Diode Array; BomGroup: Микросхемы; BomItemTitle: Супрессор; BomTitle: Микросхема; Type: SP4045-04ATG
VT4 = Transistor_P-MOSFET_Enh_Bulk_Shot: as VT3 on sheet Main; Case: SOT-23-3
VT5 = Transistor_N-MOSFET_Enh_Bulk_Shot: N-канальный полевой транзистор с изолированным затвором обогащенного типа с соединением истока и подложки с диодом Шоттки; BomGroup: Транзисторы; BomTitle: Транзистор N-канальный; Case: SOT-23-3
XS1 = HR911105A: RJ-45 socket with magnetics; BomGroup: Соединители; BomTitle: Розетка RJ-45 с трансформатором; Type: HR911105A

## Sheet USB-C_Adapter.SchDoc
size A4
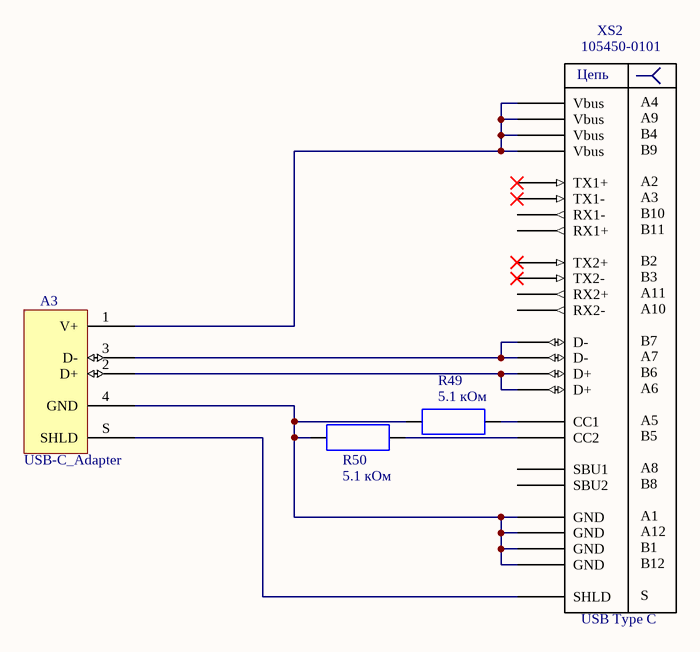
[diagram p5: USB-C_Adapter.SchDoc]

### Parts
A3  USB-C_Adapter  [Usb-C_Adapter]  (no BOM)
R49  value 5.1 кОм  [RES_0603-1608]  (hidden comment: Res)
R50  value 5.1 кОм  [RES_0603-1608]  (hidden comment: Res)
XS2  USB Type C  [105450-0101]

### Nets
NetA3_1: A3.1(V+) XS2.A4(Vbus) XS2.A9(Vbus) XS2.B4(Vbus) XS2.B9(Vbus)
NetA3_2: A3.2(D+) XS2.A6(D+) XS2.B6(D+)
NetA3_3: A3.3(D-) XS2.A7(D-) XS2.B7(D-)
NetA3_4: A3.4(GND) R49.2 R50.2 XS2.A1(GND) XS2.A12(GND) XS2.B1(GND) XS2.B12(GND)
NetA3_S: A3.S(SHLD) XS2.S(SHLD)
NetR49_1: R49.1 XS2.A5(CC1)
NetR50_1: R50.1 XS2.B5(CC2)

Not connected (* = marked no-connect by the designer): XS2 A2(TX1+)* A3(TX1-)* A8(SBU1) A10(RX2-) A11(RX2+) B2(TX2+)* B3(TX2-)* B8(SBU2) B10(RX1-) B11(RX1+)

### Notes on the sheet
- (in symbol USB-C_Generic) Цепь

### Library data of the parts
R49 R50 = Res: as R13 on sheet Main; Case: 0603
XS2 = USB-C_Generic: BomGroup: Соединители; BomTitle: Гнездо USB тип C; Type: 105450-0101

## Nets that join several sheets
+3V3: Main (28 pins), ESP32 (10 pins), OUT1 (R22.1.2), OUT2 (R22.2.2), OUT3 (R22.3.2), OUT4 (R22.4.2), OUT5 (R22.5.2), OUT6 (R22.6.2), OUT7 (R22.7.2), OUT8 (R22.8.2), IN1 (R10.1.2), IN2 (R10.2.2), IN3 (R10.3.2), IN4 (R10.4.2), IN5 (R10.5.2), IN6 (R10.6.2), IN7 (R10.7.2), IN8 (R10.8.2), IN9 (R10.9.2), IN10 (R10.10.2), IN11 (R10.11.2), IN12 (R10.12.2), IN13 (R10.13.2), IN14 (R10.14.2), IN15 (R10.15.2), IN16 (R10.16.2), Ethernet (R44.1 VT4.2)
GND: Main (48 pins), ESP32 (11 pins), IN1 (C7.1.1 U1.1.3), IN2 (C7.2.1 U1.2.3), IN3 (C7.3.1 U1.3.3), IN4 (C7.4.1 U1.4.3), IN5 (C7.5.1 U1.5.3), IN6 (C7.6.1 U1.6.3), IN7 (C7.7.1 U1.7.3), IN8 (C7.8.1 U1.8.3), IN9 (C7.9.1 U1.9.3), IN10 (C7.10.1 U1.10.3), IN11 (C7.11.1 U1.11.3), IN12 (C7.12.1 U1.12.3), IN13 (C7.13.1 U1.13.3), IN14 (C7.14.1 U1.14.3), IN15 (C7.15.1 U1.15.3), IN16 (C7.16.1 U1.16.3), Ethernet (28 pins)
#BOOT: Main (VT1.3), ESP32 (A1.25 C4.2 R6.1)
BUT1: Main (DD1.17), IN1 (C7.1.2 R12.1.1)
BUT2: Main (DD3.14), IN2 (C7.2.2 R12.2.1)
BUT3: Main (DD1.16), IN3 (C7.3.2 R12.3.1)
BUT4: Main (DD3.16), IN4 (C7.4.2 R12.4.1)
BUT5: Main (DD1.10), IN5 (C7.5.2 R12.5.1)
BUT6: Main (DD3.10), IN6 (C7.6.2 R12.6.1)
BUT7: Main (DD1.14), IN7 (C7.7.2 R12.7.1)
BUT8: Main (DD3.17), IN8 (C7.8.2 R12.8.1)
BUT9: Main (DD1.12), IN9 (C7.9.2 R12.9.1)
BUT10: Main (DD3.19), IN10 (C7.10.2 R12.10.1)
BUT11: Main (DD1.11), IN11 (C7.11.2 R12.11.1)
BUT12: Main (DD3.20), IN12 (C7.12.2 R12.12.1)
BUT13: Main (DD1.20), IN13 (C7.13.2 R12.13.1)
BUT14: Main (DD3.11), IN14 (C7.14.2 R12.14.1)
BUT15: Main (DD1.19), IN15 (C7.15.2 R12.15.1)
BUT16: Main (DD3.12), IN16 (C7.16.2 R12.16.1)
CTL1: Main (DD2.17), OUT1 (U2.1.2)
CTL2: Main (DD2.16), OUT2 (U2.2.2)
CTL3: Main (DD2.10), OUT3 (U2.3.2)
CTL4: Main (DD2.14), OUT4 (U2.4.2)
CTL5: Main (DD2.12), OUT5 (U2.5.2)
CTL6: Main (DD2.11), OUT6 (U2.6.2)
CTL7: Main (DD2.20), OUT7 (U2.7.2)
CTL8: Main (DD2.19), OUT8 (U2.8.2)
NetA1_3: Main (VD4.1 VD5.1), ESP32 (A1.3 C2.2 R1.1)
NetA1_4: Main (VD14.5 XP6.5), ESP32 (A1.4)
NetA1_6: Main (DD3.1), ESP32 (A1.6)
NetA1_7: Main (DD1.1), ESP32 (A1.7)
NetA1_10: ESP32 (A1.10), Ethernet (D1.11 R30.1)
NetA1_11: ESP32 (A1.11), Ethernet (D1.10 R31.1)
NetA1_12: ESP32 (A1.12), Ethernet (D1.15 R29.1)
NetA1_13: Main (VD7.5 XP5.7), ESP32 (A1.13 R2.1)
NetA1_14: Main (VD8.5 XP5.5), ESP32 (A1.14 R4.1)
NetA1_16: Main (R14.2 VD7.4), ESP32 (A1.16 R3.1)
NetA1_26: Main (5 pins), ESP32 (A1.26 R7.2)
NetA1_27: ESP32 (A1.27), Ethernet (R45.2)
NetA1_29: Main (5 pins), ESP32 (A1.29 R8.2)
NetA1_30: ESP32 (A1.30), Ethernet (D1.16 R28.1)
NetA1_31: ESP32 (A1.31), Ethernet (D1.22)
NetA1_33: ESP32 (A1.33), Ethernet (D1.21)
NetA1_36: ESP32 (A1.36), Ethernet (D1.23)
NetA1_37: ESP32 (A1.37), Ethernet (D1.17)
NetR5_1: Main (VD6.5 XP5.13), ESP32 (R5.1)
NetR11.1_1: Main (XP3.1 XP4.1), IN1 (R11.1.1), IN2 (R11.2.1), IN3 (R11.3.1), IN4 (R11.4.1), IN5 (R11.5.1), IN6 (R11.6.1), IN7 (R11.7.1), IN8 (R11.8.1), IN9 (R11.9.1), IN10 (R11.10.1), IN11 (R11.11.1), IN12 (R11.12.1), IN13 (R11.13.1), IN14 (R11.14.1), IN15 (R11.15.1), IN16 (R11.16.1)
PHYCLK: ESP32 (A1.28), Ethernet (D1.5)
URX: Main (DD4.26), ESP32 (A1.34)
UTX: Main (DD4.25), ESP32 (A1.35)